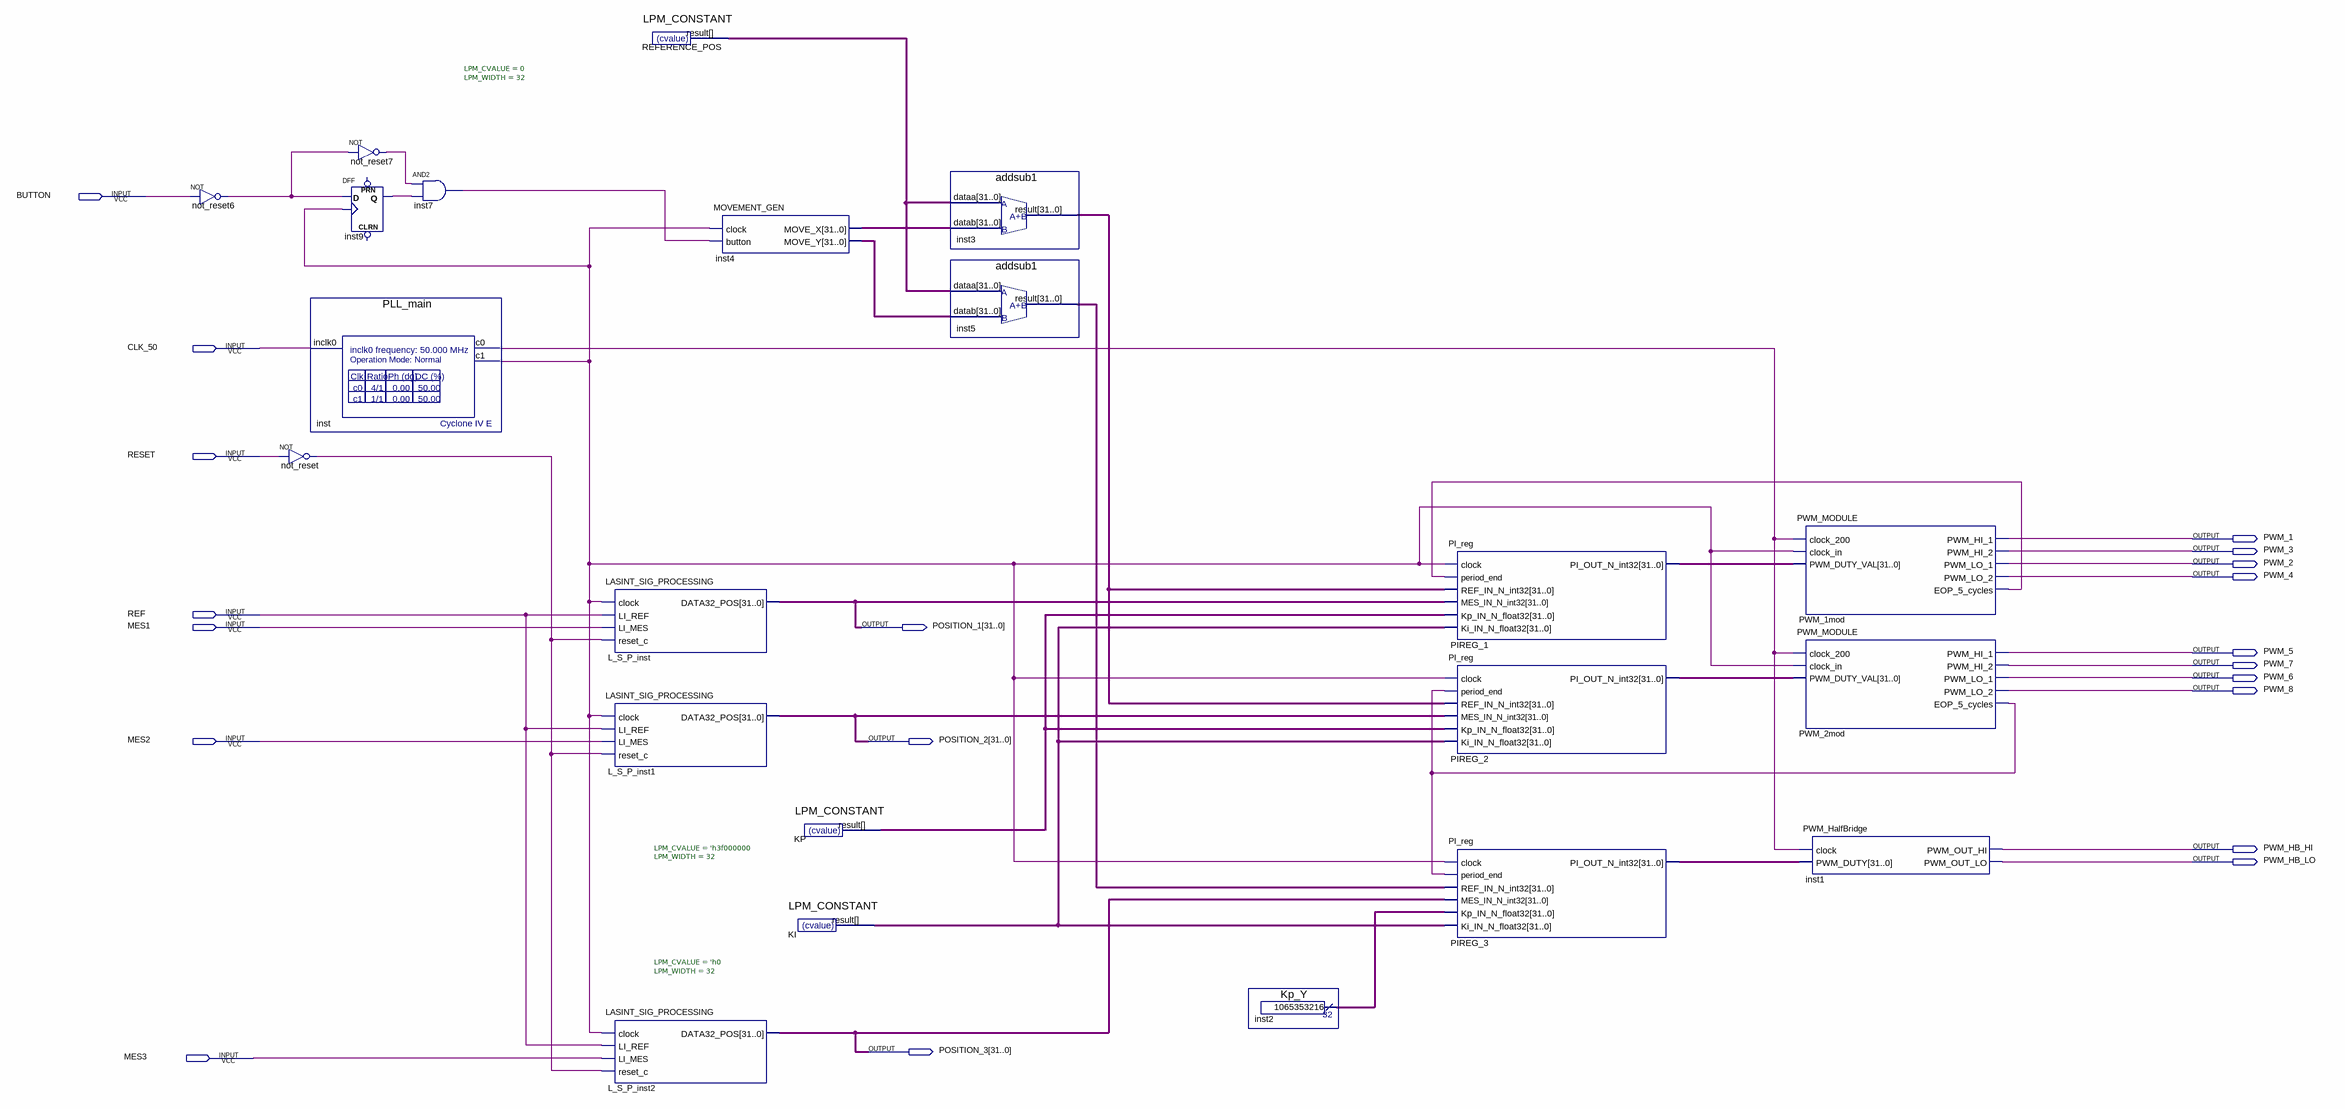
[diagram p0: schematic sheet]
// Quartus schematic LI_sensor.bdf as structural Verilog: 22 symbols, 20 pins
module LI_sensor (
  input  BUTTON,
  input  CLK_50,
  input  RESET,
  input  REF,
  input  MES1,
  input  MES2,
  input  MES3,
  output PWM_1,
  output PWM_3,
  output PWM_2,
  output PWM_4,
  output [31:0] POSITION_1,
  output PWM_5,
  output PWM_7,
  output PWM_6,
  output PWM_8,
  output [31:0] POSITION_2,
  output PWM_HB_HI,
  output PWM_HB_LO,
  output [31:0] POSITION_3
);

  wire inst7_out, inst9_q, inst_c0, inst_c1, not_reset6_out, not_reset7_out, not_reset_out,
       PWM_1mod_eop_5_cycles, PWM_2mod_eop_5_cycles;
  wire [31:0] inst2_result, inst3_result, inst4_move_x, inst4_move_y, inst5_result, KI_result, KP_result,
       PIREG_1_pi_out_n_int32, PIREG_2_pi_out_n_int32, PIREG_3_pi_out_n_int32, REFERENCE_POS_result;

  not not_reset6 (not_reset6_out, BUTTON);
  not not_reset (not_reset_out, RESET);
  DFF inst9 (.CLK(inst_c1), .D(not_reset6_out), .Q(inst9_q));  // open: CLRN, PRN
  PLL_main inst (.inclk0(CLK_50), .c0(inst_c0), .c1(inst_c1));
  not not_reset7 (not_reset7_out, not_reset6_out);
  and inst7 (inst7_out, not_reset7_out, inst9_q);
  LPM_CONSTANT #(.LPM_CVALUE(0), .LPM_WIDTH(32)) REFERENCE_POS (.result(REFERENCE_POS_result));
  LASINT_SIG_PROCESSING L_S_P_inst (
    .clock(inst_c1), .LI_REF(REF), .LI_MES(MES1), .reset_c(not_reset_out), .DATA32_POS(POSITION_1));
  LASINT_SIG_PROCESSING L_S_P_inst1 (
    .clock(inst_c1), .LI_REF(REF), .LI_MES(MES2), .reset_c(not_reset_out), .DATA32_POS(POSITION_2));
  LASINT_SIG_PROCESSING L_S_P_inst2 (
    .clock(inst_c1), .LI_REF(REF), .LI_MES(MES3), .reset_c(not_reset_out), .DATA32_POS(POSITION_3));
  MOVEMENT_GEN inst4 (.clock(inst_c1), .button(inst7_out), .MOVE_X(inst4_move_x), .MOVE_Y(inst4_move_y));
  LPM_CONSTANT #(.LPM_CVALUE('h3f000000), .LPM_WIDTH(32)) KP (.result(KP_result));
  LPM_CONSTANT #(.LPM_CVALUE('h0), .LPM_WIDTH(32)) KI (.result(KI_result));
  addsub1 inst3 (.dataa(REFERENCE_POS_result), .datab(inst4_move_x), .result(inst3_result));
  addsub1 inst5 (.dataa(REFERENCE_POS_result), .datab(inst4_move_y), .result(inst5_result));
  Kp_Y inst2 (.result(inst2_result));
  PI_reg PIREG_1 (
    .clock(inst_c1), .period_end(PWM_1mod_eop_5_cycles), .REF_IN_N_int32(inst3_result),
    .MES_IN_N_int32(POSITION_1), .Kp_IN_N_float32(KP_result), .Ki_IN_N_float32(KI_result),
    .PI_OUT_N_int32(PIREG_1_pi_out_n_int32));
  PI_reg PIREG_2 (
    .clock(inst_c1), .period_end(PWM_2mod_eop_5_cycles), .REF_IN_N_int32(inst3_result),
    .MES_IN_N_int32(POSITION_2), .Kp_IN_N_float32(KP_result), .Ki_IN_N_float32(KI_result),
    .PI_OUT_N_int32(PIREG_2_pi_out_n_int32));
  PI_reg PIREG_3 (
    .clock(inst_c1), .period_end(PWM_2mod_eop_5_cycles), .REF_IN_N_int32(inst5_result),
    .MES_IN_N_int32(POSITION_3), .Kp_IN_N_float32(inst2_result), .Ki_IN_N_float32(KI_result),
    .PI_OUT_N_int32(PIREG_3_pi_out_n_int32));
  PWM_MODULE PWM_1mod (
    .clock_200(inst_c0), .clock_in(inst_c1), .PWM_DUTY_VAL(PIREG_1_pi_out_n_int32), .PWM_HI_1(PWM_1),
    .PWM_HI_2(PWM_3), .PWM_LO_1(PWM_2), .PWM_LO_2(PWM_4), .EOP_5_cycles(PWM_1mod_eop_5_cycles));
  PWM_MODULE PWM_2mod (
    .clock_200(inst_c0), .clock_in(inst_c1), .PWM_DUTY_VAL(PIREG_2_pi_out_n_int32), .PWM_HI_1(PWM_5),
    .PWM_HI_2(PWM_7), .PWM_LO_1(PWM_6), .PWM_LO_2(PWM_8), .EOP_5_cycles(PWM_2mod_eop_5_cycles));
  PWM_HalfBridge inst1 (
    .clock(inst_c0), .PWM_DUTY(PIREG_3_pi_out_n_int32), .PWM_OUT_HI(PWM_HB_HI), .PWM_OUT_LO(PWM_HB_LO));
endmodule
